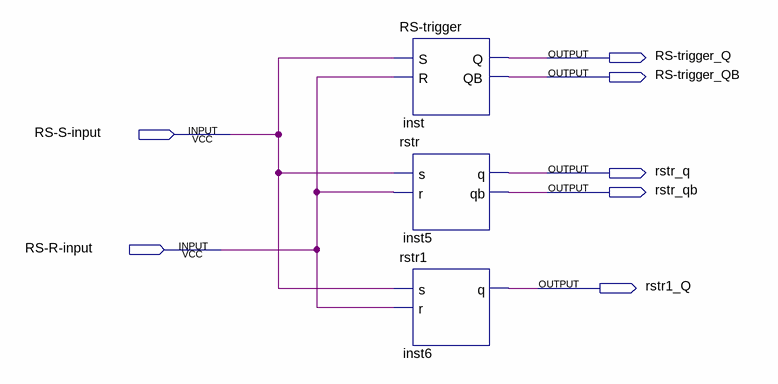
[diagram p0: schematic sheet]
// Quartus schematic RS-test.bdf as structural Verilog: 3 symbols, 7 pins
module \RS-test  (
  input  \RS-S-input ,
  input  \RS-R-input ,
  output \RS-trigger_Q ,
  output \RS-trigger_QB ,
  output rstr_q,
  output rstr_qb,
  output rstr1_Q
);

  \RS-trigger  inst (.S(\RS-S-input ), .R(\RS-R-input ), .Q(\RS-trigger_Q ), .QB(\RS-trigger_QB ));
  rstr inst5 (.s(\RS-S-input ), .r(\RS-R-input ), .q(rstr_q), .qb(rstr_qb));
  rstr1 inst6 (.s(\RS-S-input ), .r(\RS-R-input ), .q(rstr1_Q));
endmodule
